# Altium project Remote.PrjPcb
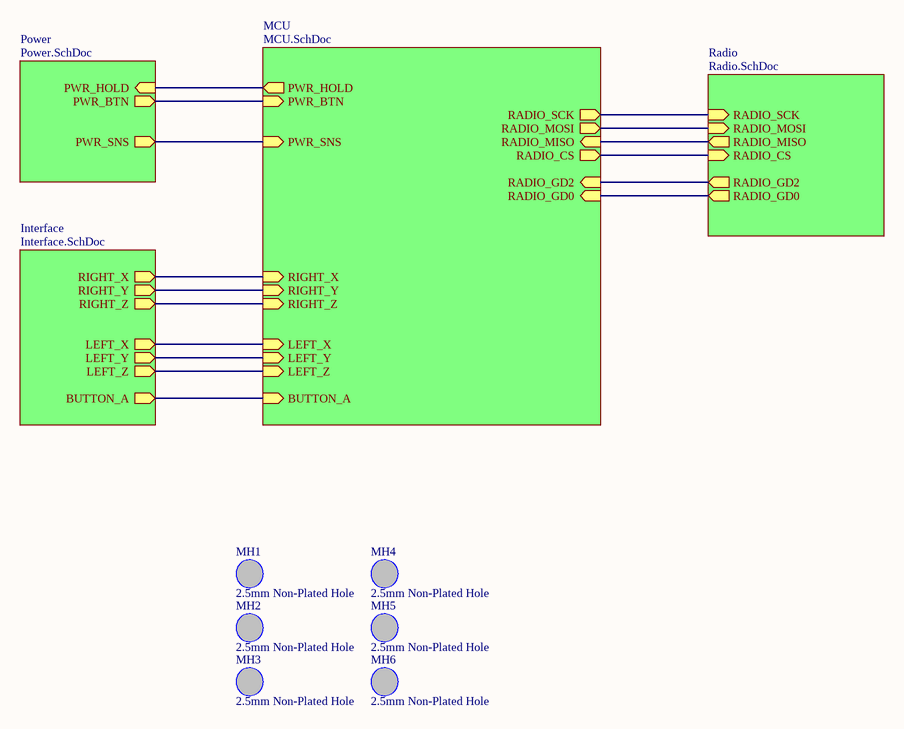
[diagram p0: Top.SchDoc]
Project_Revision: 1.0; Project_Client: Client; Project_Board_Name: A7V Remote
5 sheets, 54 parts. Net scope: hierarchical (ports join the sheet entries above them; power ports are global).
Board file: Remote.PcbDoc
Sheets:
  Top.SchDoc
    Power = Power.SchDoc
    Interface = Interface.SchDoc
    MCU = MCU.SchDoc
    Radio = Radio.SchDoc

## Sheet Top.SchDoc: Top Level
size A3; CompanyName: NOT USED; DocumentNumber: 5; SheetNumber: 5; SheetTotal: 5; PageSetup: Record=PageOptions|CenterHorizontal=True|CenterVertical=True|PrintScale=1.00|XCorrection=1.00|YCorrection=1.00|PrintKind=0|BorderSize=5000000|LeftOffset=0|BottomOffset=0|Orientation=2|PaperLength=1000|PaperWidth=1000|Scale=100|PaperSource=7|PrintQuality=-4|MediaType=1|DitherType=10|PaperKind=A3|PrintScaleMode=0

### Parts
MH1  2.5mm Non-Plated Hole  [MTG250X550]  (no BOM)
MH2  2.5mm Non-Plated Hole  [MTG250X550]  (no BOM)
MH3  2.5mm Non-Plated Hole  [MTG250X550]  (no BOM)
MH4  2.5mm Non-Plated Hole  [MTG250X550]  (no BOM)
MH5  2.5mm Non-Plated Hole  [MTG250X550]  (no BOM)
MH6  2.5mm Non-Plated Hole  [MTG250X550]  (no BOM)

### Sub-sheets
Interface = Interface.SchDoc: RIGHT_X (out), RIGHT_Z (out), RIGHT_Y (out), LEFT_X (out), LEFT_Y (out), LEFT_Z (out), BUTTON_A (out)
MCU = MCU.SchDoc: RADIO_SCK (out), RADIO_MOSI (out), LEFT_Y (in), RIGHT_Y (in), RADIO_MISO (in), RIGHT_Z (in), LEFT_Z (in), RIGHT_X (in), LEFT_X (in), RADIO_CS (out), PWR_HOLD (out), BUTTON_A (in), PWR_SNS (in), PWR_BTN (in), RADIO_GD2 (in), RADIO_GD0 (in)
Power = Power.SchDoc: PWR_HOLD (in), PWR_BTN (out), PWR_SNS (out)
Radio = Radio.SchDoc: RADIO_GD2 (out), RADIO_GD0 (out), RADIO_SCK (in), RADIO_CS (in), RADIO_MOSI (in), RADIO_MISO (out)

### Nets
NetD1_2: sheet Power/PWR_BTN, sheet MCU/PWR_BTN
NetQ2_1: sheet Power/PWR_HOLD, sheet MCU/PWR_HOLD
NetR8_1: sheet Power/PWR_SNS, sheet MCU/PWR_SNS
NetS1_3: sheet Interface/BUTTON_A, sheet MCU/BUTTON_A
NetSW1_S4: sheet Interface/LEFT_Z, sheet MCU/LEFT_Z
NetSW1_X2: sheet Interface/LEFT_X, sheet MCU/LEFT_X
NetSW1_Y2: sheet Interface/LEFT_Y, sheet MCU/LEFT_Y
NetSW2_S4: sheet Interface/RIGHT_Z, sheet MCU/RIGHT_Z
NetSW2_X2: sheet Interface/RIGHT_X, sheet MCU/RIGHT_X
NetSW2_Y2: sheet Interface/RIGHT_Y, sheet MCU/RIGHT_Y
NetU1_1: sheet MCU/RADIO_SCK, sheet Radio/RADIO_SCK
NetU1_2: sheet MCU/RADIO_MISO, sheet Radio/RADIO_MISO
NetU1_3: sheet MCU/RADIO_GD2, sheet Radio/RADIO_GD2
NetU1_6: sheet MCU/RADIO_GD0, sheet Radio/RADIO_GD0
NetU1_7: sheet MCU/RADIO_CS, sheet Radio/RADIO_CS
NetU1_20: sheet MCU/RADIO_MOSI, sheet Radio/RADIO_MOSI

### Notes on the sheet
- Project
- Size:
- Date:
- A3
- Revision:
- Sheet
- of
- Lambo
- File:

### Library data of the parts
MH1-MH6 = NONPART-007: Display_Name: 2.5mm Non-Plated Hole; BWA PN: NONPART-007; Schematic Symbol: HOLE_UNPLATED

## Sheet Power.SchDoc: Top Level
size A3; CompanyName: NOT USED; DocumentNumber: 4; SheetNumber: 4; SheetTotal: 5; PageSetup: Record=PageOptions|CenterHorizontal=True|CenterVertical=True|PrintScale=1.00|XCorrection=1.00|YCorrection=1.00|PrintKind=0|BorderSize=5000000|LeftOffset=0|BottomOffset=0|Orientation=2|PaperLength=1000|PaperWidth=1000|Scale=100|PaperSource=7|PrintQuality=-4|MediaType=1|DitherType=10|PaperKind=A3|PrintScaleMode=0
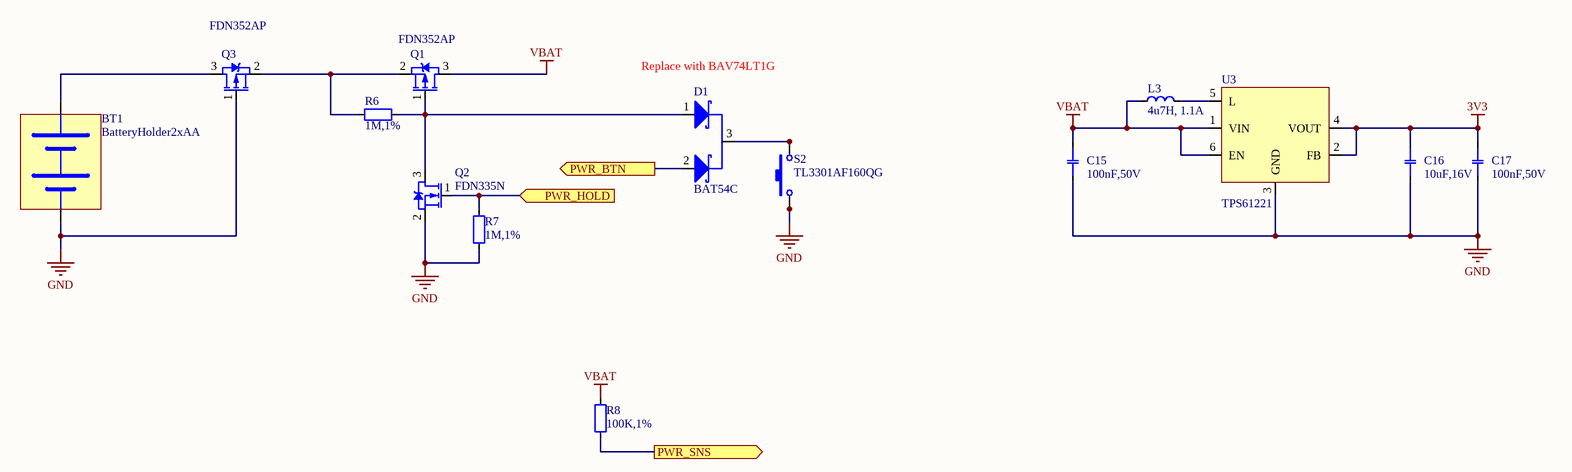
[diagram p1: Power.SchDoc]

### Parts
BT1  BatteryHolder2xAA  [BATTERY_HOLDER_2AA]
C15  100nF,50V  [CAPC1608X09N_0603]
C16  10uF,16V  [CAPC2012X12N_0805]
C17  100nF,50V  [CAPC1608X09N_0603]
D1  BAT54C  [SOT95P237X111-3N_SOT23]
L3  4u7H, 1.1A  [INDC2520X12N_1008]
Q1  FDN352AP  [SOT95P230X110-3N_SOT23]
Q2  FDN335N  [SOT95P230X110-3N_SOT23]
Q3  FDN352AP  [SOT95P230X110-3N_SOT23]
R6  1M,1%  [RESC1608X06N_0603]
R7  1M,1%  [RESC1608X06N_0603]
R8  100K,1%  [RESC1608X06N_0603]
S2  TL3301AF160QG  [SW_TL3301AFXXXXG]
U3  TPS61221  [TSOP65P210X100-6N_SC70]

### Ports
PWR_BTN (out), PWR_HOLD (in), PWR_SNS (out)

### Nets
3V3: C16.2 C17.2 U3.2(FB) U3.4(VOUT)
GND: BT1.2(-) C15.1 C16.1 C17.1 Q2.2(S) Q3.1(G) R7.2 S2.1 S2.2 U3.3(GND)
VBAT: C15.2 L3.1 Q1.3(D) R8.2 U3.1(VIN) U3.6(EN)
NetBT1_1: BT1.1(+) Q3.3(D)
NetD1_1: D1.1(A1) Q1.1(G) Q2.3(D) R6.1
NetD1_2: D1.2(A2) ; port PWR_BTN
NetD1_3: D1.3(C1/C2) S2.3 S2.4
NetL3_2: L3.2 U3.5(L)
NetQ1_2: Q1.2(S) Q3.2(S) R6.2
NetQ2_1: Q2.1(G) R7.1 ; port PWR_HOLD
NetR8_1: R8.1 ; port PWR_SNS

### Notes on the sheet
- (near D1) Replace with BAV74LT1G
- Project
- Size:
- Date:
- A3
- Revision:
- Sheet
- of
- Lambo
- File:

### Library data of the parts
C15 C17 = CCH-104CH-G: CAP CER 0.1UF 50V 10% X7R 0603; Manufacturer: Kemet; Manufacturer Part Number: C0603C104K5RACTU; Type: Ceramic; Display_Name: 100nF,50V; Capacitance: 100nF; Dielectric: X7R; Tolerance: 10%; Voltage: 50V; BWA PN: CCH-104CH-G; Schematic Symbol: CAP-NP_1; Supplier 1: Digi-Key; Supplier Part Number 1: 399-5089-1-ND
C16 = CCI-106CD-G: CAP CER 10µF ±10% 16V X7R 0805; Manufacturer: Samsung Electro-Mechanics America, Inc.; Manufacturer Part Number: CL21B106KOQNNNG; Type: Ceramic; Display_Name: 10uF,16V; Capacitance: 10uF; Dielectric: X7R; Tolerance: 10%; Voltage: 16V; BWA PN: CCI-106CD-G; Schematic Symbol: CAP-NP_1; Supplier 1: Digi-Key; Supplier Part Number 1: 1276-6472-1-ND
D1 = DIO-10192-A: DIODE ARRAY SCHOTTKY 30V SOT23-3; Manufacturer: Fairchild/ON Semiconductor; Vf@I: 800mV @ 100mA; d_if(max): 200mA; Display_Name: BAT54C; Type: Schottky; BWA PN: DIO-10192-A; Vr(max): 30V; Schematic Symbol: BAT54C; Manufacturer Part Number: BAT54C; Supplier 1: Digi-Key; Supplier Part Number 1: BAT54CFSCT-ND
L3 = IND-10165-A: INDUCTOR POWER 4.7UH 1.1A SMD; Manufacturer: Murata Electronics North America; Manufacturer Part Number: DFE252010R-H-4R7M=P2; Sheilding: Unsheilded; Type: Wirewound; DC Resistance: 276mOhm; Display_Name: 4u7H, 1.1A; Inductance: 4u7H; BWA PN: IND-10165-A; Current Rating: 1.1A; Schematic Symbol: INDUCTOR_1; Supplier 1: Digi-Key; Supplier Part Number 1: 490-10646-1-ND
Q1 Q3 = TRN-10006-A: MOSFET P-CH 30V 1.3A SSOT-3; Manufacturer: Fairchild; Type: P; Id(max): -1.3A; rds(on): 180mOhms; Vds(max): -30V; Vgs(max): +/-25V; Vth(max): -2.5V; Display_Name: FDN352AP; BWA PN: TRN-10006-A; Schematic Symbol: MOSFET-P_1; Manufacturer Part Number: FDN352AP; Supplier 1: Digi-Key; Supplier Part Number 1: FDN352APCT-ND
Q2 = TRN-10045-A: MOSFET N-CH 20V 1.7A SSOT3; Manufacturer: Fairchild Semiconductor; Type: N; rds(on): 70mOhm; Vgs(max): +/-8V; Vth(max): 1.5V; Display_Name: FDN335N; BWA PN: TRN-10045-A; Id(max): 1.7A; Vds(max): 20V; Schematic Symbol: MOSFET-N_1; Manufacturer Part Number: FDN335N; Supplier 1: Digi-Key; Supplier Part Number 1: FDN335NCT-ND
R6 R7 = RSH-1M000-D: RES 1.00M OHM 1/10W 1% 0603 SMD; Manufacturer: Yageo; Manufacturer Part Number: RC0603FR-071ML; Power: 0.1W; Display_Name: 1M,1%; Resistance: 1M; Tolerance: 1%; Type: Chip; BWA PN: RSH-1M000-D; Schematic Symbol: RESISTOR_1; Supplier 1: Digi-Key; Supplier Part Number 1: 311-1.00MHRCT-ND
R8 = RSH-100K0-D: RES 100K OHM 1/10W 1% 0603 SMD; Manufacturer: Yageo; Manufacturer Part Number: RC0603FR-07100KL; Power: 0.1W; Display_Name: 100K,1%; Resistance: 100K; Tolerance: 1%; Type: Chip; BWA PN: RSH-100K0-D; Schematic Symbol: RESISTOR_1; Supplier 1: Digi-Key; Supplier Part Number 1: 311-100KHRCT-ND
S2 = SWT-10009-A: SWITCH TACT 160GF H=5.0MM SMT; Manufacturer: E-Switch; Circuit: SPST-NO; Function: Off-Mom; Display_Name: TL3301AF160QG; Type: Tactile; BWA PN: SWT-10009-A; Schematic Symbol: SW_SPST_2; Manufacturer Part Number: TL3301AF160QG; Supplier 1: Digi-Key; Supplier Part Number 1: EG2526CT-ND
U3 = ICT-10893-A: IC REG BOOST 3.3V 200MA SC70-6; Manufacturer: Texas Instruments; Manufacturer Part Number: TPS61221DCKT; Temp Range: -40°C ~ 125°C (TJ); Display_Name: TPS61221; BWA PN: ICT-10893-A; Schematic Symbol: TPS61221; Supplier 1: Digi-Key; Supplier Part Number 1: 296-24171-1-ND

## Sheet Interface.SchDoc: Top Level
size A3; CompanyName: NOT USED; DocumentNumber: 3; SheetNumber: 3; SheetTotal: 5; PageSetup: Record=PageOptions|CenterHorizontal=True|CenterVertical=True|PrintScale=1.00|XCorrection=1.00|YCorrection=1.00|PrintKind=0|BorderSize=5000000|LeftOffset=0|BottomOffset=0|Orientation=2|PaperLength=1000|PaperWidth=1000|Scale=100|PaperSource=7|PrintQuality=-4|MediaType=1|DitherType=10|PaperKind=A3|PrintScaleMode=0
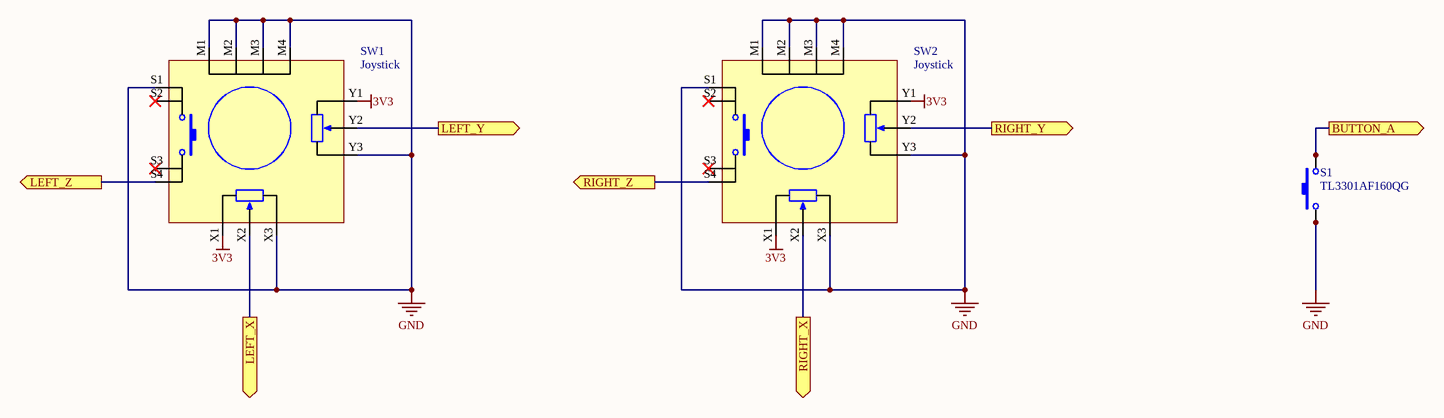
[diagram p2: Interface.SchDoc]

### Parts
S1  TL3301AF160QG  [SW_TL3301AFXXXXG]
SW1  Joystick  [Joystick]
SW2  Joystick  [Joystick]

### Ports
BUTTON_A (out), LEFT_X (out), LEFT_Y (out), LEFT_Z (out), RIGHT_X (out), RIGHT_Y (out), RIGHT_Z (out)

### Nets
3V3: SW1.X1 SW1.Y1 SW2.X1 SW2.Y1
GND: S1.1 S1.2 SW1.M1 SW1.M2 SW1.M3 SW1.M4 SW1.S1 SW1.X3 SW1.Y3 SW2.M1 SW2.M2 SW2.M3 SW2.M4 SW2.S1 SW2.X3 SW2.Y3
NetS1_3: S1.3 S1.4 ; port BUTTON_A
NetSW1_S4: SW1.S4 ; port LEFT_Z
NetSW1_X2: SW1.X2 ; port LEFT_X
NetSW1_Y2: SW1.Y2 ; port LEFT_Y
NetSW2_S4: SW2.S4 ; port RIGHT_Z
NetSW2_X2: SW2.X2 ; port RIGHT_X
NetSW2_Y2: SW2.Y2 ; port RIGHT_Y

Not connected (* = marked no-connect by the designer): SW1 S2* S3*; SW2 S2* S3*

### Notes on the sheet
- Project
- Size:
- Date:
- A3
- Revision:
- Sheet
- of
- Lambo
- File:

### Library data of the parts
S1 = SWT-10009-A: as S2 on sheet Power; Display_Name: TL3301AF160QG; Type: Tactile; BWA PN: SWT-10009-A; Schematic Symbol: SW_SPST_2; Manufacturer Part Number: TL3301AF160QG; Supplier 1: Digi-Key; Supplier Part Number 1: EG2526CT-ND

## Sheet MCU.SchDoc: Top Level
size A3; CompanyName: NOT USED; DocumentNumber: 2; SheetNumber: 2; SheetTotal: 5; PageSetup: Record=PageOptions|CenterHorizontal=True|CenterVertical=True|PrintScale=1.00|XCorrection=1.00|YCorrection=1.00|PrintKind=0|BorderSize=5000000|LeftOffset=0|BottomOffset=0|Orientation=2|PaperLength=1000|PaperWidth=1000|Scale=100|PaperSource=7|PrintQuality=-4|MediaType=1|DitherType=10|PaperKind=A3|PrintScaleMode=0
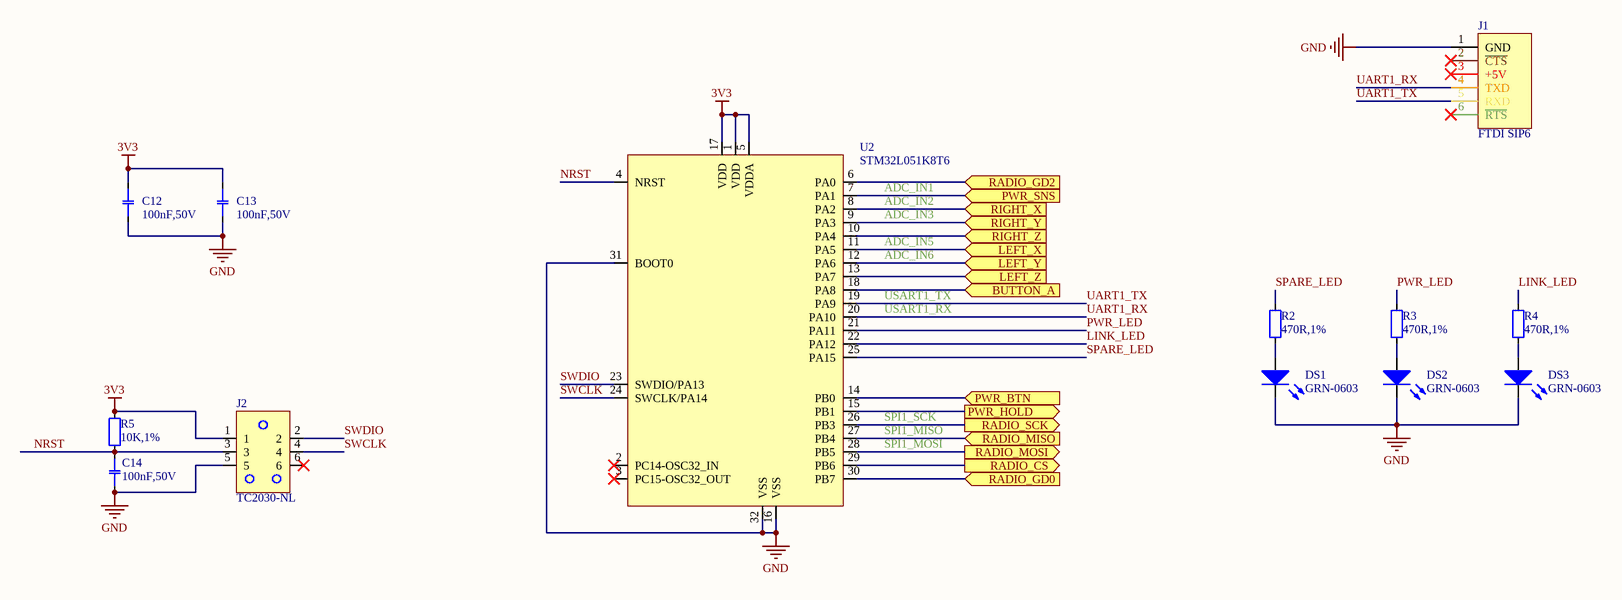
[diagram p3: MCU.SchDoc]

### Parts
C12  100nF,50V  [CAPC1608X09N_0603]
C13  100nF,50V  [CAPC1608X09N_0603]
C14  100nF,50V  [CAPC1608X09N_0603]
DS1  GRN-0603  [LED_SML-LX0603]
DS2  GRN-0603  [LED_SML-LX0603]
DS3  GRN-0603  [LED_SML-LX0603]
J1  FTDI SIP6  [HIROSE_A2-6PA-2.54DSA]
J2  TC2030-NL  [TAGCON_TC2030-IDC-NL]  (no BOM)
R2  470R,1%  [RESC1608X06N_0603]
R3  470R,1%  [RESC1608X06N_0603]
R4  470R,1%  [RESC1608X06N_0603]
R5  10K,1%  [RESC1608X06N_0603]
U2  STM32L051K8T6  [LQFP32]

### Ports
BUTTON_A (in), LEFT_X (in), LEFT_Y (in), LEFT_Z (in), PWR_BTN (in), PWR_HOLD (out), PWR_SNS (in), RADIO_CS (out), RADIO_GD0 (in), RADIO_GD2 (in), RADIO_MISO (in), RADIO_MOSI (out), RADIO_SCK (out), RIGHT_X (in), RIGHT_Y (in), RIGHT_Z (in)

### Nets
3V3: C12.2 C13.2 J2.1 R5.2 U2.1(VDD) U2.5(VDDA) U2.17(VDD)
GND: C12.1 C13.1 C14.2 DS1.1(C) DS2.1(C) DS3.1(C) J1.1(GND) J2.5 U2.16(VSS) U2.31(BOOT0) U2.32(VSS)
LINK_LED: R4.2 U2.22(PA12)
NRST: C14.1 J2.3 R5.1 U2.4(NRST)
PWR_LED: R3.2 U2.21(PA11)
SPARE_LED: R2.2 U2.25(PA15)
SWCLK: J2.4 U2.24(SWCLK/PA14)
SWDIO: J2.2 U2.23(SWDIO/PA13)
UART1_RX: J1.4(TXD) U2.20(PA10)
UART1_TX: J1.5(RXD) U2.19(PA9)
NetD1_2: U2.14(PB0) ; port PWR_BTN
NetDS1_2: DS1.2(A) R2.1
NetDS2_2: DS2.2(A) R3.1
NetDS3_2: DS3.2(A) R4.1
NetQ2_1: U2.15(PB1) ; port PWR_HOLD
NetR8_1: U2.7(PA1) ; port PWR_SNS
NetS1_3: U2.18(PA8) ; port BUTTON_A
NetSW1_S4: U2.13(PA7) ; port LEFT_Z
NetSW1_X2: U2.11(PA5) ; port LEFT_X
NetSW1_Y2: U2.12(PA6) ; port LEFT_Y
NetSW2_S4: U2.10(PA4) ; port RIGHT_Z
NetSW2_X2: U2.8(PA2) ; port RIGHT_X
NetSW2_Y2: U2.9(PA3) ; port RIGHT_Y
NetU1_1: U2.26(PB3) ; port RADIO_SCK
NetU1_2: U2.27(PB4) ; port RADIO_MISO
NetU1_3: U2.6(PA0) ; port RADIO_GD2
NetU1_6: U2.30(PB7) ; port RADIO_GD0
NetU1_7: U2.29(PB6) ; port RADIO_CS
NetU1_20: U2.28(PB5) ; port RADIO_MOSI

Not connected (* = marked no-connect by the designer): J1 2(~{CTS})* 3(+5V)* 6(~{RTS})*; J2 6*; U2 2(PC14-OSC32_IN)* 3(PC15-OSC32_OUT)*

### Notes on the sheet
- (near U2) ADC_IN1
- (near U2) ADC_IN2
- (near U2) ADC_IN3
- (near U2) USART1_TX
- (near U2) ADC_IN5
- (near U2) ADC_IN6
- (near U2) USART1_RX
- (near U2) SPI1_SCK
- (near U2) SPI1_MISO
- (near U2) SPI1_MOSI
- Project
- Size:
- Date:
- A3
- Revision:
- Sheet
- of
- Lambo
- File:

### Library data of the parts
C12-C14 = CCH-104CH-G: as C15 on sheet Power; Display_Name: 100nF,50V; Capacitance: 100nF; Dielectric: X7R; Tolerance: 10%; Voltage: 50V; BWA PN: CCH-104CH-G; Schematic Symbol: CAP-NP_1; Supplier 1: Digi-Key; Supplier Part Number 1: 399-5089-1-ND
DS1-DS3 = LED-10087-A: LED GREEN CLEAR 0603 SMD; Manufacturer: Dialight; Manufacturer Part Number: 5988081107F; Wavelength: 523nm; Axial Intensity: 300mcd; If(max): 20mA; Lens Style/Size: 0603; Vf@I: 3.2V; Viewing Angle: 140; Display_Name: GRN-0603; BWA PN: LED-10087-A; Colour: GREEN; Lens type: clear; Vr(max): -; Schematic Symbol: LED_1; Supplier 1: Digi-Key; Supplier Part Number 1: 350-2036-1-ND
J1 = CON-10749-A: FTDI Serial Header; Manufacturer: Hirose Electric Co Ltd; Manufacturer Part Number: A2-6PA-2.54DSA(71); Contacts: 6; Pitch: 2.54mm; Rows: 1; Display_Name: FTDI SIP6; Type: Header; BWA PN: CON-10749-A; Schematic Symbol: FTDI_TTL_232R; Supplier 1: Digi-Key; Supplier Part Number 1: H123043-ND
J2 = NONPART-056: Tag connect 6 way - No Legs; Display_Name: TC2030-NL; BWA PN: NONPART-056; Schematic Symbol: TAGCON_TC2030-IDC
R2-R4 = RSH-470R0-D: RES 470 OHM 1/10W 1% 0603 SMD; Manufacturer: Rohm Semiconductor; Manufacturer Part Number: MCR03EZPFX4700; Power: 0.1W; Display_Name: 470R,1%; Resistance: 470R; Tolerance: 1%; Type: Chip; BWA PN: RSH-470R0-D; Schematic Symbol: RESISTOR_1; Supplier 1: Digi-Key; Supplier Part Number 1: RHM470HCT-ND
R5 = RSH-10K00-D: RES 10.0K OHM 1/10W 1% 0603 SMD; Manufacturer: Yageo; Manufacturer Part Number: RC0603FR-0710KL; Power: 0.1W; Display_Name: 10K,1%; Resistance: 10K; Tolerance: 1%; Type: Chip; BWA PN: RSH-10K00-D; Schematic Symbol: RESISTOR_1; Supplier 1: Digi-Key; Supplier Part Number 1: 311-10.0KHRCT-ND
U2 = ICT-10696-A: 32 Bit Mcirocontroler; Manufacturer: ST Microelectronics; Temp Range: -40°C ~ 85°C; Display_Name: STM32L051K8T6; BWA PN: ICT-10696-A; Schematic Symbol: STM32L051x6/8; Manufacturer Part Number: STM32L051K8T6; Supplier 1: Digi-Key; Supplier Part Number 1: 497-14901-ND

## Sheet Radio.SchDoc: Top Level
size A3; CompanyName: NOT USED; DocumentNumber: 1; SheetNumber: 1; SheetTotal: 5; PageSetup: Record=PageOptions|CenterHorizontal=True|CenterVertical=True|PrintScale=1.00|XCorrection=1.00|YCorrection=1.00|PrintKind=0|BorderSize=5000000|LeftOffset=0|BottomOffset=0|Orientation=2|PaperLength=1000|PaperWidth=1000|Scale=100|PaperSource=7|PrintQuality=-4|MediaType=1|DitherType=10|PaperKind=A3|PrintScaleMode=0
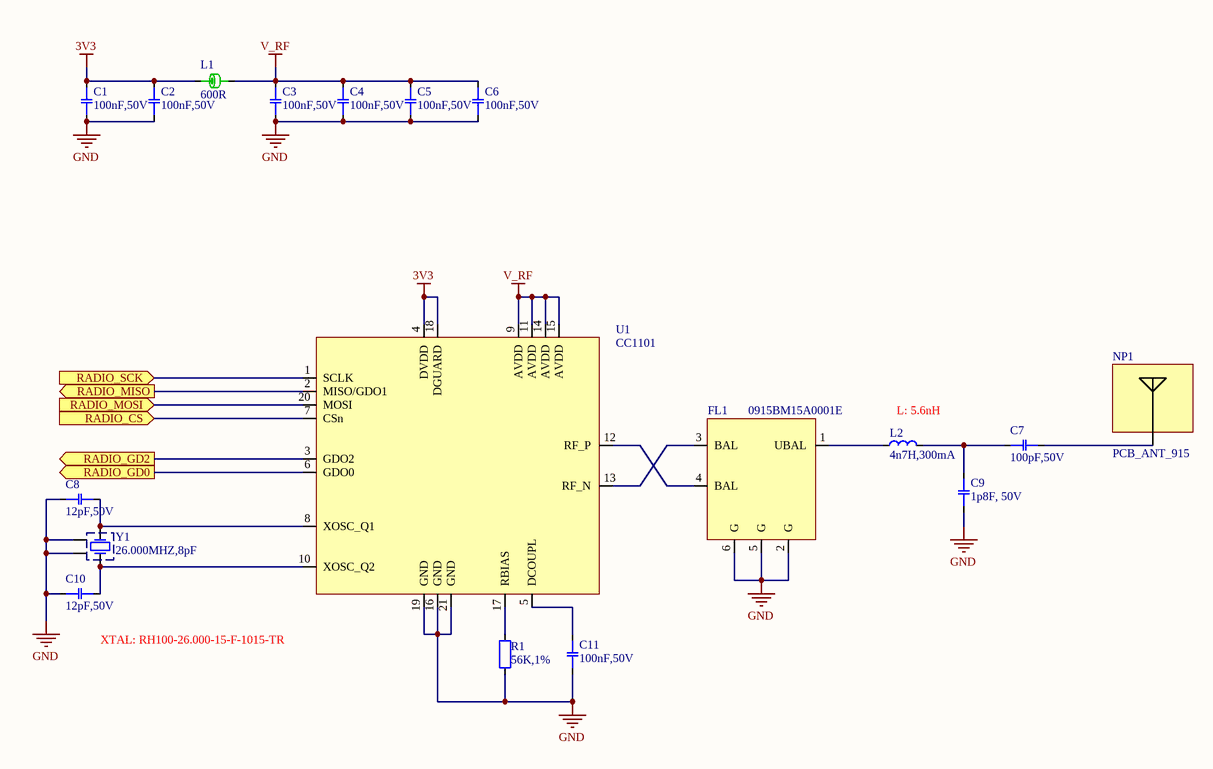
[diagram p4: Radio.SchDoc]

### Parts
C1  100nF,50V  [CAPC1005X05N_0402]
C2  100nF,50V  [CAPC1005X05N_0402]
C3  100nF,50V  [CAPC1005X05N_0402]
C4  100nF,50V  [CAPC1005X05N_0402]
C5  100nF,50V  [CAPC1005X05N_0402]
C6  100nF,50V  [CAPC1005X05N_0402]
C7  100pF,50V  [CAPC1005X05N_0402]
C8  12pF,50V  [CAPC1005X05N_0402]
C9  1p8F, 50V  [CAPC1005X05N_0402]
C10  12pF,50V  [CAPC1005X05N_0402]
C11  100nF,50V  [CAPC1005X05N_0402]
FL1  0915BM15A0001E  [FLTR65P200X125-6N_0805]
L1  600R  [INDC1608X10N_0603]
L2  4n7H,300mA  [INDC1005X04N_0402]
NP1  PCB_ANT_915  [ANT_PCB_915]
R1  56K,1%  [RESC1005X04N_0402]
U1  CC1101  [QFN50P400X400X75-20N_20QFN]
Y1  26.000MHZ,8pF  [XTAL_NX3225SA]

### Ports
RADIO_CS (in), RADIO_GD0 (out), RADIO_GD2 (out), RADIO_MISO (out), RADIO_MOSI (in), RADIO_SCK (in)

### Nets
3V3: C1.2 C2.2 L1.1 U1.4(DVDD) U1.18(DGUARD)
GND: C1.1 C2.1 C3.1 C4.1 C5.1 C6.1 C8.1 C9.1 C10.1 C11.1 FL1.2(G) FL1.5(G) FL1.6(G) R1.1 U1.16(GND) U1.19(GND) U1.21(GND) Y1.2 Y1.4
V_RF: C3.2 C4.2 C5.2 C6.2 L1.2 U1.9(AVDD) U1.11(AVDD) U1.14(AVDD) U1.15(AVDD)
NetC7_1: C7.1 C9.2 L2.2
NetC7_2: C7.2 NP1.1(ANT)
NetC8_2: C8.2 U1.8(XOSC_Q1) Y1.1
NetC10_2: C10.2 U1.10(XOSC_Q2) Y1.3
NetC11_2: C11.2 U1.5(DCOUPL)
NetFL1_1: FL1.1(UBAL) L2.1
NetFL1_3: FL1.3(BAL) U1.13(RF_N)
NetFL1_4: FL1.4(BAL) U1.12(RF_P)
NetR1_2: R1.2 U1.17(RBIAS)
NetU1_1: U1.1(SCLK) ; port RADIO_SCK
NetU1_2: U1.2(MISO/GDO1) ; port RADIO_MISO
NetU1_3: U1.3(GDO2) ; port RADIO_GD2
NetU1_6: U1.6(GDO0) ; port RADIO_GD0
NetU1_7: U1.7(CSn) ; port RADIO_CS
NetU1_20: U1.20(MOSI) ; port RADIO_MOSI

### Notes on the sheet
- (near L2) L: 5.6nH
- XTAL: RH100-26.000-15-F-1015-TR
- Project
- Size:
- Date:
- A3
- Revision:
- Sheet
- of
- Lambo
- File:

### Library data of the parts
C1-C6 C11 = CCG-104DE-H: CAP CER 0.1UF 50V X7R 0402; Manufacturer: Taiyo Yuden; Manufacturer Part Number: UMK105B7104KV-FR; Tolerance: 10%; Type: Ceramic; Display_Name: 100nF,50V; Capacitance: 100nF; Dielectric: X7R; Voltage: 50V; BWA PN: CCG-104DE-H; Schematic Symbol: CAP-NP_1; Supplier 1: Digi-Key; Supplier Part Number 1: 587-3498-1-ND
C7 = CCG-101PAH-F: CAP CER 100PF 50V 5% NP0 0402; Manufacturer: Murata Electronics North America; Manufacturer Part Number: GRM1555C1H101JA01D; Dielectric: NPO; Type: Ceramic; Display_Name: 100pF,50V; Capacitance: 100pF; Tolerance: 5%; Voltage: 50V; BWA PN: CCG-101PAH-F; Schematic Symbol: CAP-NP_1; Supplier 1: Digi-Key; Supplier Part Number 1: 490-5922-1-ND
C8 C10 = CCG-12PAH-F: CAP CER 12PF 50V 5% NP0 0402; Manufacturer: Murata Electronics North America; Manufacturer Part Number: GRM1555C1H120JA01D; Dielectric: NPO; Type: Ceramic; Display_Name: 12pF,50V; Capacitance: 12pF; Tolerance: 5%; Voltage: 50V; BWA PN: CCG-12PAH-F; Schematic Symbol: CAP-NP_1; Supplier 1: Digi-Key; Supplier Part Number 1: 490-5924-1-ND
C9 = CCG-1P8AH-F: CAP CER 1.8PF 50V C0G/NP0 0402; Manufacturer: Murata Electronics North America; Manufacturer Part Number: GJM1555C1H1R8BB01D; Dielectric: Ceramic; Tolerance: ±0.1pF; Display_Name: 1p8F, 50V; Capacitance: 1p8F; Type: C0G/NP0; Voltage: 50V; BWA PN: CCG-1P8AH-F; Schematic Symbol: CAP-NP_1; Supplier 1: Digi-Key; Supplier Part Number 1: 490-8089-1-ND
FL1 = ICT-10614-A: BALUN 902MHZ-928MHZ 0805; Manufacturer: Johanson Technology Inc; Display_Name: 0915BM15A0001E; BWA PN: ICT-10614-A; Schematic Symbol: ____BM15A0001E; Manufacturer Part Number: 0915BM15A0001E; Supplier 1: Digi-Key; Supplier Part Number 1: 712-1541-1-ND
L1 = IND-10163-A: FERRITE BEAD 600 OHM 0603 1LN; Manufacturer: Wurth Electronics Inc; Manufacturer Part Number: 742792651; Inductance: 600Ohm @ 100MHz; Current Rating: 1A; DC Resistance: 200mOhm; Schematic Symbol: INDUCTOR_1; Display_Name: 600R; BWA PN: IND-10163-A; Supplier 1: Digi-Key; Supplier Part Number 1: 732-1593-1-ND
L2 = IND-10145-A: INDUCTOR 4.7NH 300MA 0402; Manufacturer: Murata Electronics North America; Manufacturer Part Number: LQG15HS4N7S02D; Sheilding: Unshielded; Type: Air; DC Resistance: 180mOhm; Display_Name: 4n7H,300mA; Inductance: 4n7H; BWA PN: IND-10145-A; Current Rating: 300mA; Schematic Symbol: INDUCTOR_1; Supplier 1: Digi-Key; Supplier Part Number 1: 490-2618-1-ND
R1 = RSG-56K00-D: RES 56.0K OHM 1/16W 1% 0402 SMD; Manufacturer: Yageo; Manufacturer Part Number: RC0402FR-0756KL; Power: 0.063W; Display_Name: 56K,1%; Resistance: 56K; Tolerance: 1%; Type: Chip; BWA PN: RSG-56K00-D; Schematic Symbol: RESISTOR_1; Supplier 1: Digi-Key; Supplier Part Number 1: 311-56.0KLRCT-ND
U1 = ICT-10885-A: IC RF TXRX ISM<1GHZ 20VFQFN; Manufacturer: Texas Instruments; Manufacturer Part Number: CC1101RGPR; Temp Range: -40°C ~ 85°C; Display_Name: CC1101; BWA PN: ICT-10885-A; Schematic Symbol: CC1101; Supplier 1: Digi-Key; Supplier Part Number 1: 296-35718-1-ND
Y1 = XTL-10058-A: CRYSTAL 26MHZ 8PF SMD; Manufacturer: NDK; Manufacturer Part Number: NX3225SA-26.000000MHZ-STD-CSR-1; Accuracy: ±15ppm; Display_Name: 26.000MHZ,8pF; Frequency: 26MHz; Type: Fundamental; BWA PN: XTL-10058-A; Load Capacitance: 8pF; Schematic Symbol: XTAL_2; Supplier 1: Digi-Key; Supplier Part Number 1: 644-1054-1-ND

## Nets that join several sheets
3V3: Power (C16.2 C17.2 U3.2 U3.4), Interface (SW1.X1 SW1.Y1 SW2.X1 SW2.Y1), MCU (7 pins), Radio (5 pins)
GND: Power (10 pins), Interface (16 pins), MCU (11 pins), Radio (19 pins)
NetD1_2: Power (D1.2), MCU (U2.14)
NetQ2_1: Power (Q2.1 R7.1), MCU (U2.15)
NetR8_1: Power (R8.1), MCU (U2.7)
NetS1_3: Interface (S1.3 S1.4), MCU (U2.18)
NetSW1_S4: Interface (SW1.S4), MCU (U2.13)
NetSW1_X2: Interface (SW1.X2), MCU (U2.11)
NetSW1_Y2: Interface (SW1.Y2), MCU (U2.12)
NetSW2_S4: Interface (SW2.S4), MCU (U2.10)
NetSW2_X2: Interface (SW2.X2), MCU (U2.8)
NetSW2_Y2: Interface (SW2.Y2), MCU (U2.9)
NetU1_1: MCU (U2.26), Radio (U1.1)
NetU1_2: MCU (U2.27), Radio (U1.2)
NetU1_3: MCU (U2.6), Radio (U1.3)
NetU1_6: MCU (U2.30), Radio (U1.6)
NetU1_7: MCU (U2.29), Radio (U1.7)
NetU1_20: MCU (U2.28), Radio (U1.20)

## Assembly variants
Default: not fitted J2 J3